# EAGLE schematic Connections (EAGLE 9.5.1)
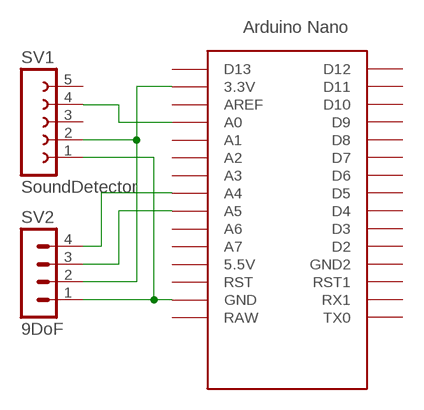
[diagram p0: schematic, sheet 1]

## Parts
SV1  SoundDetector  FE05-1  [FE05-1]
SV2  9DoF  MA04-1  [MA04-1]
U$1  NANO  [NANO]

## Nets
N$1: SV1.1 SV2.1 U$1.GND
N$2: SV1.2 SV2.2 U$1.3.3V
N$3: SV2.3 U$1.A5
N$4: SV2.4 U$1.A4
N$5: SV1.4 U$1.A0
Unconnected: SV1.3 SV1.5 U$1.5V(5.5V) U$1.A1 U$1.A2 U$1.A3 U$1.A6 U$1.A7 U$1.AREF U$1.D2 U$1.D3 U$1.D4 U$1.D5 U$1.D6 U$1.D7 U$1.D8 U$1.D9 U$1.D10 U$1.D11 U$1.D12 U$1.D13 U$1.GND1(GND2) U$1.ICSP1 U$1.ICSP2 U$1.ICSP3 U$1.ICSP4 U$1.ICSP5 U$1.ICSP6 U$1.RAW U$1.RST U$1.RST1 U$1.RX1 U$1.TX0

## Library data of the parts
SV1 = con-lsta:FE05-1: FEMALE HEADER; OC_FARNELL: unknown; OC_NEWARK: unknown
SV2 = con-lstb:MA04-1: PIN HEADER; OC_FARNELL: unknown; OC_NEWARK: unknown
U$1 = Arduino-clone:NANO: Arduino Nano